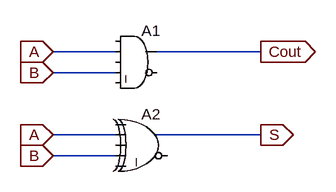
[diagram p0: schematic Half_Adder.asc]
Half_Adder.asc, the LTspice schematic file:
Version 4
SHEET 1 880 680
WIRE 144 64 48 64
WIRE 368 64 208 64
WIRE 144 96 48 96
WIRE 144 192 48 192
WIRE 368 192 208 192
WIRE 144 224 48 224
FLAG 48 64 A
IOPIN 48 64 In
FLAG 48 96 B
IOPIN 48 96 In
FLAG 48 192 A
IOPIN 48 192 In
FLAG 48 224 B
IOPIN 48 224 In
FLAG 368 192 S
IOPIN 368 192 Out
FLAG 368 64 Cout
IOPIN 368 64 Out
SYMBOL Digital\\and 176 16 R0
SYMATTR InstName A1
SYMBOL Digital\\xor 192 144 R0
SYMATTR InstName A2

The netlist it stands for:
* Half_Adder.asc
A1 0 A 0 B 0 0 Cout 0 AND
A2 0 A 0 B 0 0 S 0 XOR
.backanno
.end